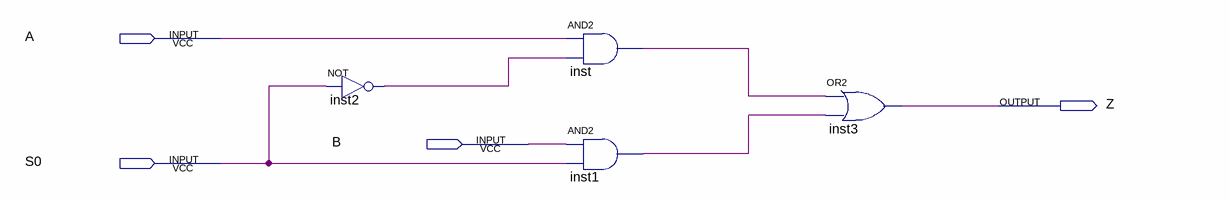
[diagram p0: schematic sheet]
// Quartus schematic MUX2_1.bdf as structural Verilog: 4 symbols, 4 pins
module MUX2_1 (
  input  A,
  input  B,
  input  S0,
  output Z
);

  wire inst1_out, inst2_out, inst_out;

  not inst2 (inst2_out, S0);
  and inst (inst_out, A, inst2_out);
  and inst1 (inst1_out, B, S0);
  or inst3 (Z, inst_out, inst1_out);
endmodule
